# Altium schematic sheet USB-TTL.SchDoc
size A4; DocumentNumber: 12; SheetNumber: 12; SheetTotal: 12
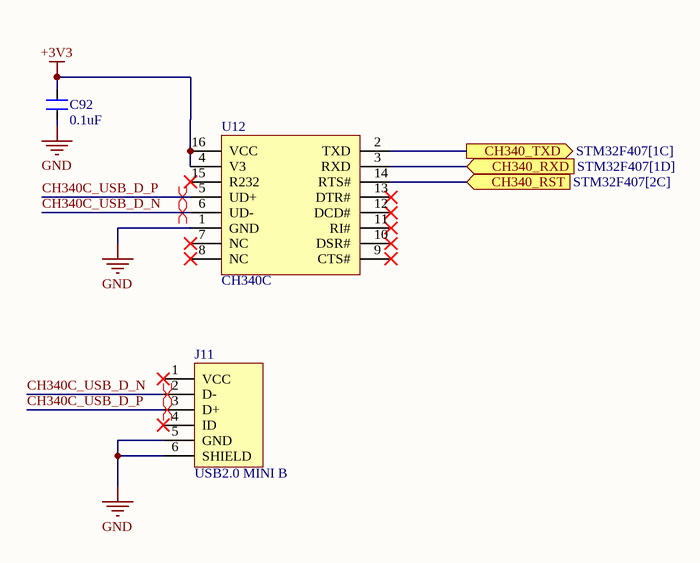
[diagram p0: USB-TTL.SchDoc]

## Parts
C92  0.1uF  [CAP_0805]
J11  USB2.0 MINI B  [CON_690-005-299-043]
U12  CH340C  [SOIC16_50_284_25X90_SMT]

## Ports
CH340_RST (in, see STM32F407[2C]), CH340_RXD (in, see STM32F407[1D]), CH340_TXD (out, see STM32F407[1C])

## Nets
+3V3: C92.2 U12.4(V3) U12.16(VCC)
GND: C92.1 J11.5(GND) J11.6(SHIELD) U12.1(GND)
CH340_RST: U12.14(RTS#) ; port CH340_RST
CH340_RXD: U12.3(RXD) ; port CH340_RXD
CH340_TXD: U12.2(TXD) ; port CH340_TXD
CH340C_USB_D_N: J11.2(D-) U12.6(UD-)
CH340C_USB_D_P: J11.3(D+) U12.5(UD+)

Not connected (* = marked no-connect by the designer): J11 1(VCC)* 4(ID)*; U12 7(NC)* 8(NC)* 9(CTS#)* 10(DSR#)* 11(RI#)* 12(DCD#)* 13(DTR#)* 15(R232)*

## Layout directives
differential pair: CH340C_USB_D_N, CH340C_USB_D_P

## Library data of the parts
C92 = CAP_0.1uF-50V-10%-0805: 0.1µF ±10% 50V Ceramic Capacitor X7R 0805 (2012 Metric); Manufacturer: Samsung; Manufacturer Part Number: CL21B104KBCNNNC; Alternate Part Number-1: NA; Case/Package: 0805; Supplier-1: SIRICOM; Supplier Part Number-1: 0805B104K500CT
J11 = CON_USB2.0-MINIB-SMD: USB - mini B USB 2.0 Receptacle Connector 5 Position Surface Mount, Right Angle; Manufacturer: EDAC; Manufacturer Part Number: 690-005-299-043; Alternate Part Number-1: NA; Case/Package: USB-MINI-B; Supplier-1: LCSC; Supplier Part Number-1: C105424
U12 = IC_CH340C: USB Bridge, USB to UART USB 2.0 UART Interface; Manufacturer: Olimex; Alternate Part Number-1: NA; Manufacturer Part Number: CH340C; Case/Package: SOIC16; Supplier-1: LCSC; Supplier Part Number-1: C84681